# EAGLE schematic s2 (EAGLE 6.5.0)
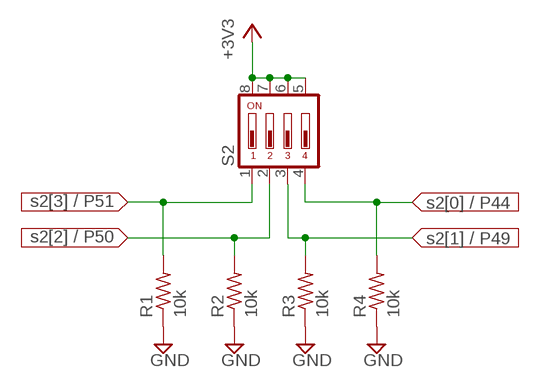
[diagram p0: schematic, sheet 1]

## Parts
R1  10k  R-US_0207/10  [0207/10]
R2  10k  R-US_0207/10  [0207/10]
R3  10k  R-US_0207/10  [0207/10]
R4  10k  R-US_0207/10  [0207/10]
S2  DIP04YL  [DIP04YL]

## Nets
+3V3: S2.5 S2.6 S2.7 S2.8
GND: R1.1 R2.1 R3.1 R4.1
N$1: R1.2 S2.1
N$2: R2.2 S2.2
N$3: R3.2 S2.3
N$4: R4.2 S2.4

## Library data of the parts
R1-R4 = resistor:R-US_: RESISTOR, American symbol
S2 = switch-dil:DIP04YL: DIL/CODE SWITCH; OC_FARNELL: unknown; OC_NEWARK: unknown